# Altium schematic sheet LR.SchDoc
size 165 x 203 mm; SheetNumber: 11; SheetTotal: 15
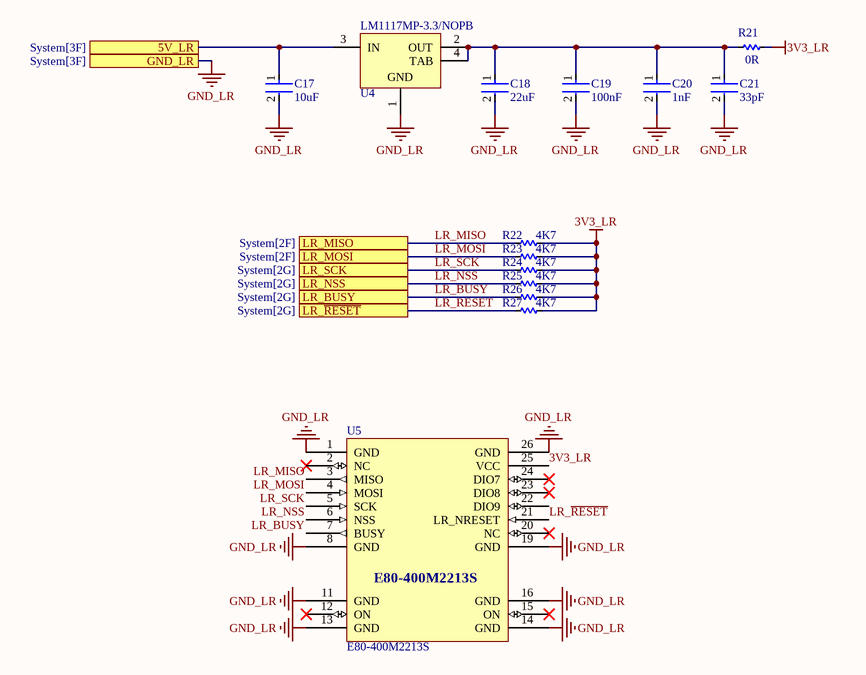
[diagram p0: LR.SchDoc]

## Parts
C17  10uF  [FP-GRM188-0_1-e0_2_0_55-IPC_A]
C18  22uF  [FP-GRM188-0_1-e0_2_0_55-IPC_A]
C19  100nF  [FP-GRM188-0_1-e0_2_0_55-IPC_A]
C20  1nF  [FP-GRM188-0_1-e0_2_0_55-IPC_A]
C21  33pF  [FP-GRM188-0_1-e0_2_0_55-IPC_A]
R21  0R  [RES-SMD-0603]
R22  4K7  [RES-SMD-0603]
R23  4K7  [RES-SMD-0603]
R24  4K7  [RES-SMD-0603]
R25  4K7  [RES-SMD-0603]
R26  4K7  [RES-SMD-0603]
R27  4K7  [RES-SMD-0603]
U4  LM1117MP-3.3/NOPB  [DCY0004A_M]
U5  E80-400M2213S  [E80-400M2213S]

## Ports
5V_LR (see System[3F]), GND_LR (see System[3F]), LR_BUSY (see System[2G]), LR_MISO (see System[2F]), LR_MOSI (see System[2F]), LR_NSS (see System[2G]), LR_SCK (see System[2G]), LR_~{RESET} (see System[2G])

## Nets
3V3_LR: R21.2 R22.2 R23.2 R24.2 R25.2 R26.2 R27.2 U5.25(VCC)
GND_LR: C17.2 C18.2 C19.2 C20.2 C21.2 U4.1(GND) U5.1(GND) U5.8(GND) U5.11(GND) U5.13(GND) U5.14(GND) U5.16(GND) U5.19(GND) U5.26(GND) ; port GND_LR
5V_LR: C17.1 U4.3(IN) ; port 5V_LR
LR_BUSY: R26.1 U5.7(BUSY) ; port LR_BUSY
LR_MISO: R22.1 U5.3(MISO) ; port LR_MISO
LR_MOSI: R23.1 U5.4(MOSI) ; port LR_MOSI
LR_NSS: R25.1 U5.6(NSS) ; port LR_NSS
LR_~{RESET}: R27.1 U5.21(LR_NRESET) ; port LR_~{RESET}
LR_SCK: R24.1 U5.5(SCK) ; port LR_SCK
NetC18_1: C18.1 C19.1 C20.1 C21.1 R21.1 U4.2(OUT) U4.4(TAB)

Not connected (* = marked no-connect by the designer): U5 2(NC)* 12(ON)* 15(ON)* 20(NC)* 22(DIO9) 23(DIO8)* 24(DIO7)*

## Library data of the parts
C17 = CMP-2006-02792-2: Chip Multilayer Ceramic Capacitors for General Purpose, 0603; Voltage Rating (DC): 6.3V; Dielectric: X5R; Tolerance: 20%; Packaging: Tape and Reel; Width: 0.031inch; Termination: SMD/SMT; Package Quantity: 4000; Voltage Rating: 6.3V; Capacitance: 10uF; Case/Package: 0603; Min Operating Temperature: -55°C; Voltage: 6.3V; Length: 1.6mm; Thickness: 0.035inch; Lead Free: Lead Free; Depth: 0.8mm; Case Code (Imperial): 0603; Max Operating Temperature: 85°C; Material: Ceramic; Height: 0.8mm; Mount: Surface Mount; REACH SVHC: No SVHC; Radiation Hardening: No; Case Code (Metric): 1608
C18-C21 = CMP-2006-02792-2: Chip Multilayer Ceramic Capacitors for General Purpose, 0603; Voltage Rating (DC): 6.3V; Dielectric: X5R; Capacitance: 10uF; Tolerance: 20%; Packaging: Tape and Reel; Width: 0.031inch; Termination: SMD/SMT; Package Quantity: 4000; Voltage Rating: 6.3V; Case/Package: 0603; Min Operating Temperature: -55°C; Voltage: 6.3V; Length: 1.6mm; Thickness: 0.035inch; Lead Free: Lead Free; Depth: 0.8mm; Case Code (Imperial): 0603; Max Operating Temperature: 85°C; Material: Ceramic; Height: 0.8mm; Mount: Surface Mount; REACH SVHC: No SVHC; Radiation Hardening: No; Case Code (Metric): 1608
R21-R27 = Res-SMD: Res 0603 5%; Manufacturer: Generic Components; Class: Passive; Published: 08/06/2000; Publisher: Altium Hobart Technology Centre
U4 = CMP-0062-01638-4: 800mA Low-Dropout Linear Regulator, 4-pin SOT-223, Pb-Free; Manufacturer: Texas Instruments; CompType: LDO IC; PackageTopMarking: XYTT*N05A; High-Reliability: Y; PowerWise: N; ComponentLink1URL: http://www.ti.com/general/docs/lit/getliterature.tsp?genericPartNumber=LM1117-N&fileType=pdf; PinCount: 4; PackageDescription: Molded SOT-223, 6.50 x 3.56 x 1.6mm Body, 4 Lead, 2.3mm Pitch; Code_IPC: SOT223-4; PartNumber: LM1117MP-3.3/NOPB; Code_JEDEC: TO-261-AA; RoHS: Y; PackageReference: DCY0004A; ComponentLink1Description: Datasheet URL
U5 = E80-400M2213S: https://www.cdebyte.com/products/E80-400M2213S/2#Pin